# EAGLE schematic circuit_diagram (EAGLE 7.7.0)
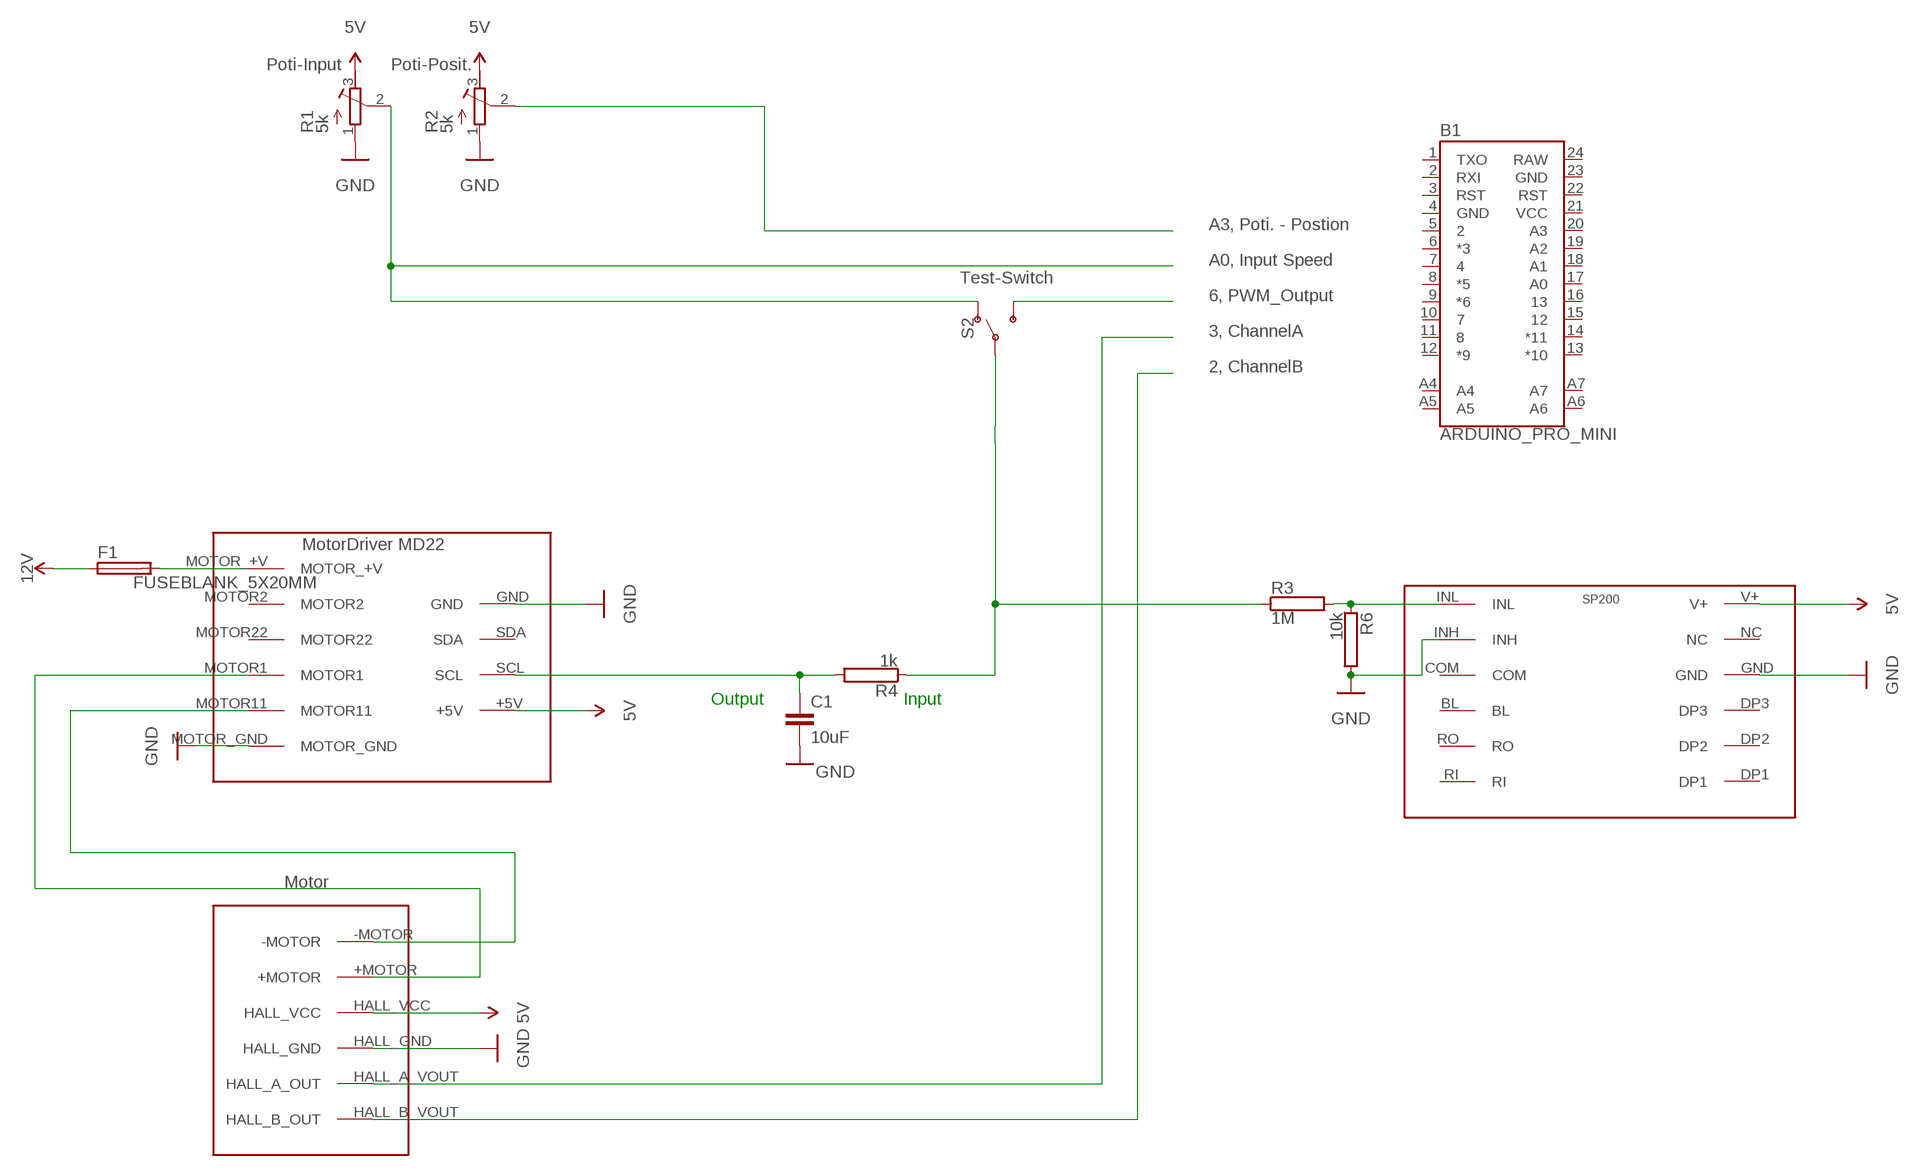
[diagram p0: schematic, sheet 1]

## Parts
B1  ARDUINO_PRO_MINI  [ARDUINO_PRO_MINI]
C1  10uF  C2,5-3  [C2.5-3]
F1  FUSEBLANK_5X20MM  [FUSE_HOLDER_5X20MM]
M1  MOTOR  [MOTOR]
R1  5k  R-TRIMM3339P  [RTRIM3339P]
R2  5k  R-TRIMM3339P  [RTRIM3339P]
R3  1M  RAC01  [AC01]
R4  1k  RAC01  [AC01]
R6  10k  RAC01  [AC01]
S2  SWITCH-SPDT-PTH-11.6X4.0MM  [SWITCH_SPDT_PTH_11.6X4.0MM]
U1  MD22  [MD22]
U$1  SP200  [SP200]

## Nets
5V: M1.HALL_VCC R1.3(E) R2.3(E) U1.+5V U$1.V+
12V: F1.1
GND: C1.2 M1.HALL_GND R1.1(A) R2.1(A) R6.2 U1.GND U1.MOTOR_GND U$1.GND U$1.INH
N$1: F1.2 U1.MOTOR_+V
N$2: M1.-MOTOR U1.MOTOR11
N$3: C1.1 R4.2 U1.SCL
N$4: S2.3(S)
N$5: M1.+MOTOR U1.MOTOR1
N$6: R1.2(S) S2.1(O)
N$7: R3.2 R6.1 U$1.INL
N$9: R2.2(S)
N$10: M1.HALL_A_VOUT(HALL_A_OUT)
N$11: M1.HALL_B_VOUT(HALL_B_OUT)
N$12: R3.1 R4.1 S2.2(P)
Unconnected: B1.1(TXO) B1.2(RXI) B1.3(RST) B1.5 B1.6(*3) B1.7 B1.8(*5) B1.9(*6) B1.10 B1.11 B1.12(*9) B1.13(*10) B1.14(*11) B1.15 B1.16 B1.17(A0) B1.18(A1) B1.19(A2) B1.20(A3) B1.22(RST) B1.A4 B1.A5 B1.A6 B1.A7 U1.MOTOR2 U1.MOTOR22 U1.SDA U$1.BL U$1.COM U$1.DP1 U$1.DP2 U$1.DP3 U$1.NC U$1.RI U$1.RO

## Notes on the sheet
- Poti-Input | Poti-Posit.
- A3, Poti. - Postion
- A0, Input Speed
- Test-Switch
- 6, PWM_Output
- 3, ChannelA
- 2, ChannelB
- Output | Input

## Power pins joined to a net without a drawn wire
GND: B1.4(GND) B1.23(GND)
RAW: B1.24(RAW)
VCC: B1.21(VCC)

## Library data of the parts
B1 = SparkFun-Boards:ARDUINO_PRO_MINI: SparkFun Pro Mini Pro Mini compatible footprint. Dimensions: 0.7 x 1.3" PCB Thickness: 0.8mm SparkFun Products: 3.3V/8MHz <https://www.sparkfun.com/products/11114> 5V/16MHz <https://www.sparkfun.com/products/11113>
C1 = capacitor-wima:C: CAPACITOR naming: grid - package width
F1 = fuse:FUSE: Fuse; OC_FARNELL: unknown; OC_NEWARK: unknown
M1 = lib_gijon:MOTOR
R1 R2 = rcl:R-TRIMM: Trimm resistor; SPICEMODEL: X; SPICEPREFIXL: POT
R3 R4 R6 = resistor-power:R: Power Resitor; OC_FARNELL: unknown; OC_NEWARK: unknown
S2 = SparkFun-Switches:SWITCH-SPDT: Single Pole, Double Throw (SPDT) Switch Single-pole, double-throw (SPDT) switch. Variant Overview SMD-AYZ0202 Surface Mount DPDT Switch <https://www.sparkfun.com/products/597> (COM-00597) Used on e.g. LilyPad Arduino USB - ATmega32U4 Board <https://www.sparkfun.com/products/12049> PTH-11.6X4.0MM SPDT Mini Power Switch <https://www.sparkfun.com/products/102> (COM-00102) Used on e.g. SparkFun Simon Says - Through-Hole Soldering Kit <https://www.sparkfun.com/products/10547> (KIT-10547) PTH-11.6X4.0MM-KIT KIT version of SPDT Mini Power Switch - Simplifies soldering by removing tStop of switch pins - only one side can be soldered. PTH-11.6X4.0MM-LOCK LOCK version of SPDT Mini Power Switch - Offset pins hold switch in place for easier soldering. SMD-RIGHT-ANGLE Surface Mount Right Angle Switch <https://www.sparkfun.com/products/10860> (COM-10860) Used on e.g. SparkFun ESP8266 Thing <https://www.sparkfun.com/products/13231>; PROD_ID: SWCH-08261; SF_SKU: COM-00102
U1 = lib_gijon:MD22
U$1 = lib_gijon:SP200